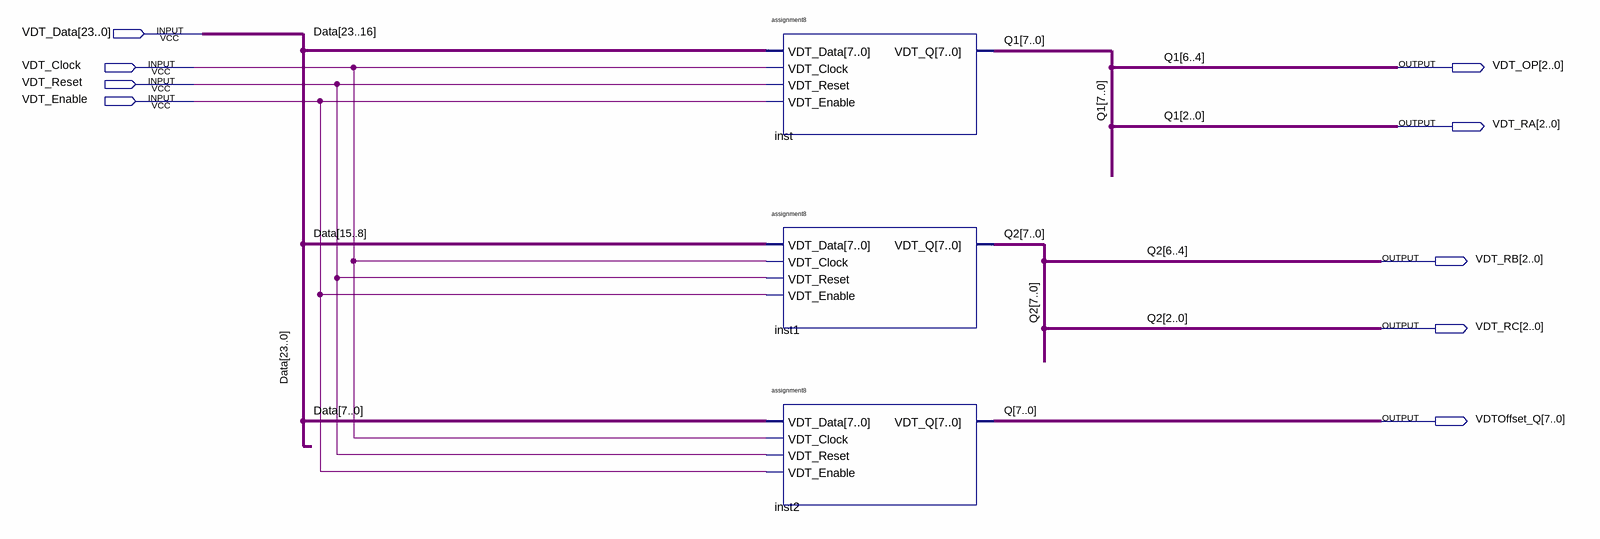
[diagram p0: schematic sheet]
// Quartus schematic assignment4_lab6.bdf as structural Verilog: 3 symbols, 9 pins
module assignment4_lab6 (
  input  [23:0] VDT_Data,
  input  VDT_Clock,
  input  VDT_Reset,
  input  VDT_Enable,
  output [2:0] VDT_OP,
  output [2:0] VDT_RA,
  output [2:0] VDT_RB,
  output [2:0] VDT_RC,
  output [7:0] VDTOffset_Q
);

  wire [7:3] Q1, Q2;

  assignment8 inst (
    .VDT_Data(VDT_Data[23:16]), .VDT_Clock(VDT_Clock), .VDT_Reset(VDT_Reset), .VDT_Enable(VDT_Enable),
    .VDT_Q({Q1[7], VDT_OP, Q1[3], VDT_RA}));
  assignment8 inst1 (
    .VDT_Data(VDT_Data[15:8]), .VDT_Clock(VDT_Clock), .VDT_Reset(VDT_Reset), .VDT_Enable(VDT_Enable),
    .VDT_Q({Q2[7], VDT_RB, Q2[3], VDT_RC}));
  assignment8 inst2 (
    .VDT_Data(VDT_Data[7:0]), .VDT_Clock(VDT_Clock), .VDT_Reset(VDT_Reset), .VDT_Enable(VDT_Enable),
    .VDT_Q(VDTOffset_Q));

  // Other names for the same wires on the sheet: Q[7:0] = VDTOffset_Q; Q1 (some bits) = {VDT_OP, VDT_RA};
  //   Q2 (some bits) = {VDT_RB, VDT_RC}; Data[23:0] = VDT_Data
endmodule
